# EAGLE schematic CPU68K20 - v1.1.2 (EAGLE 5.08)
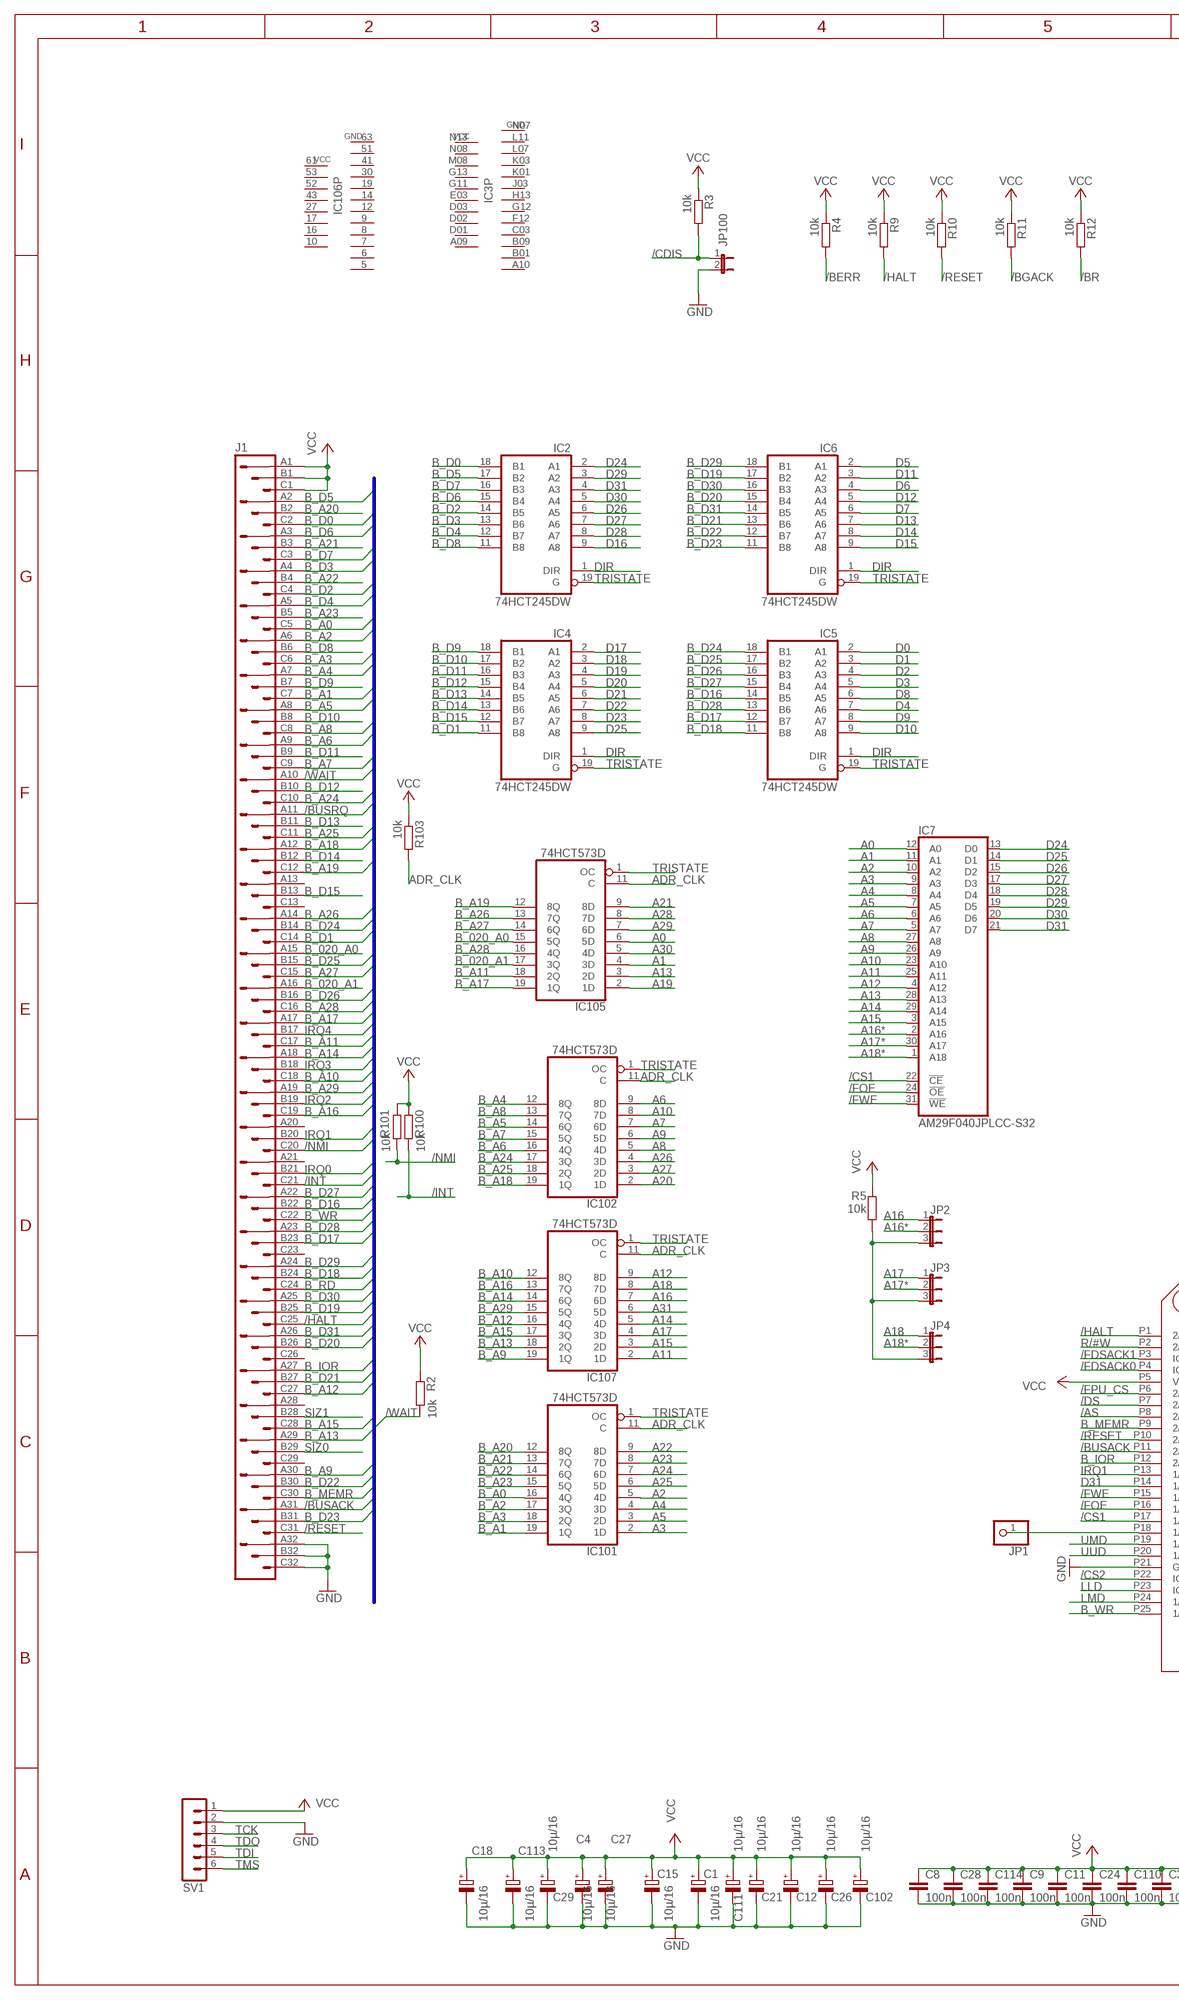
[diagram p0: schematic, sheet 1, part 1 of 2]
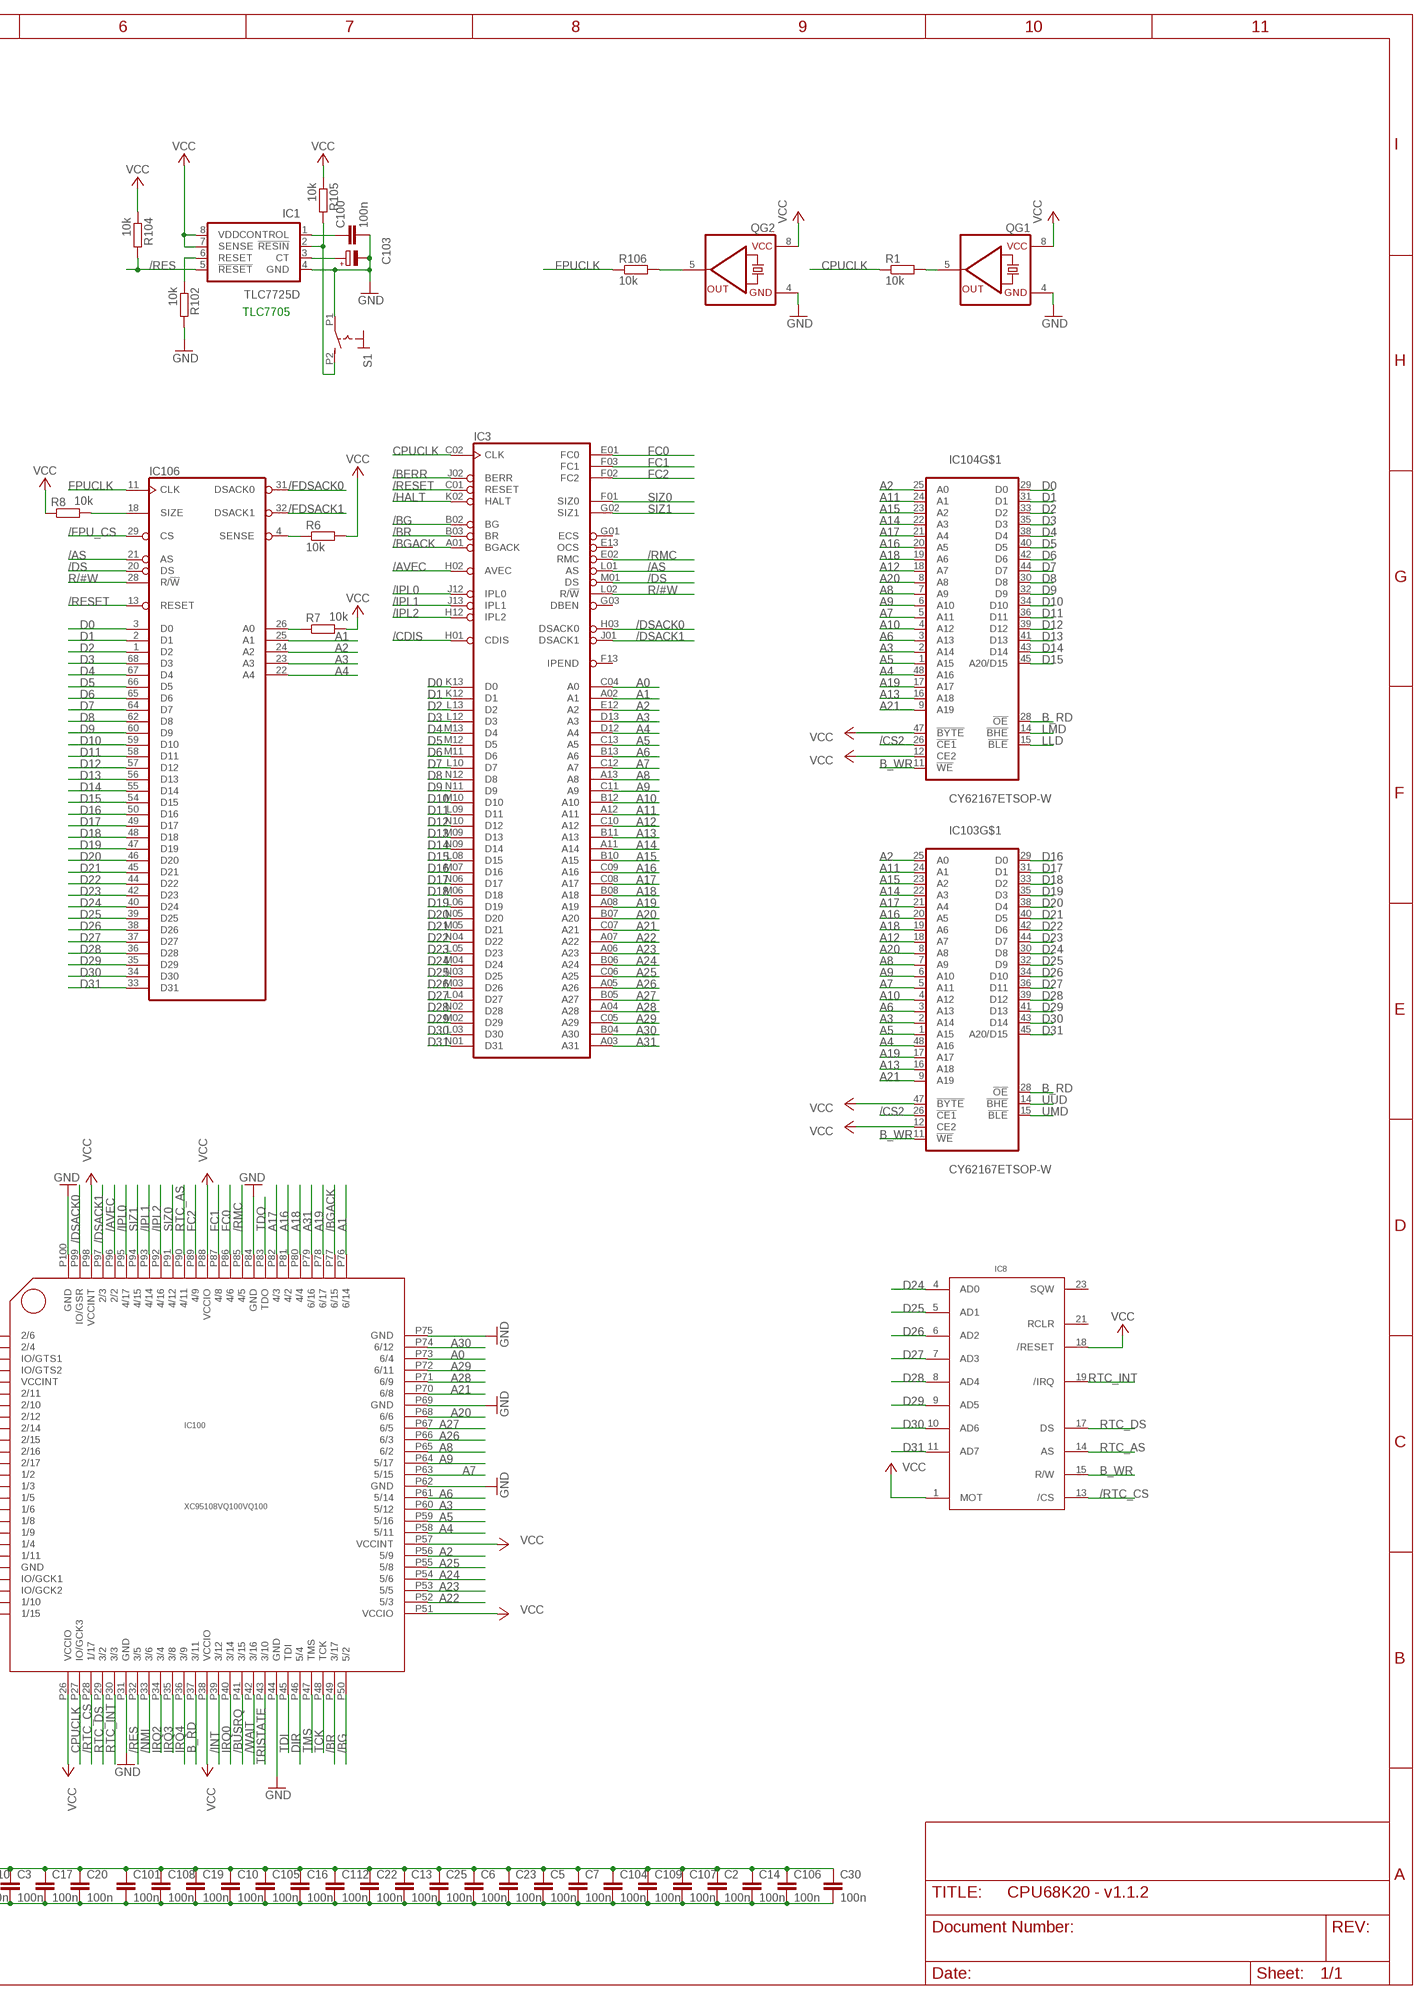
[diagram p1: schematic, sheet 1, part 2 of 2]

## Parts
C1  10µ/16  CPOL-EUSMCC  [SMC_C]
C2  100n  C-EUC0603K  [C0603K]
C3  100n  C-EUC0603K  [C0603K]
C4  10µ/16  CPOL-EUSMCC  [SMC_C]
C5  100n  C-EUC0603K  [C0603K]
C6  100n  C-EUC0603K  [C0603K]
C7  100n  C-EUC0603K  [C0603K]
C8  100n  C-EUC0603K  [C0603K]
C9  100n  C-EUC0603K  [C0603K]
C10  100n  C-EUC0603K  [C0603K]
C11  100n  C-EUC0603K  [C0603K]
C12  10µ/16  CPOL-EUSMCC  [SMC_C]
C13  100n  C-EUC0603K  [C0603K]
C14  100n  C-EUC0603K  [C0603K]
C15  10µ/16  CPOL-EUSMCC  [SMC_C]
C16  100n  C-EUC0603K  [C0603K]
C17  100n  C-EUC0603K  [C0603K]
C18  10µ/16  CPOL-EUSMCC  [SMC_C]
C19  100n  C-EUC0603K  [C0603K]
C20  100n  C-EUC0603K  [C0603K]
C21  10µ/16  CPOL-EUSMCC  [SMC_C]
C22  100n  C-EUC0603K  [C0603K]
C23  100n  C-EUC0603K  [C0603K]
C24  100n  C-EUC0603K  [C0603K]
C25  100n  C-EUC0603K  [C0603K]
C26  10µ/16  CPOL-EUSMCC  [SMC_C]
C27  10µ/16  CPOL-EUSMCC  [SMC_C]
C28  100n  C-EUC0603K  [C0603K]
C29  10µ/16  CPOL-EUSMCC  [SMC_C]
C30  100n  C-EUC0603K  [C0603K]
C100  100n  C-EUC0603K  [C0603K]
C101  100n  C-EUC0603K  [C0603K]
C102  10µ/16  CPOL-EUSMCC  [SMC_C]
C103  10µ/16  CPOL-EUSMCC  [SMC_C]
C104  100n  C-EUC0603K  [C0603K]
C105  100n  C-EUC0603K  [C0603K]
C106  100n  C-EUC0603K  [C0603K]
C107  100n  C-EUC0603K  [C0603K]
C108  100n  C-EUC0603K  [C0603K]
C109  100n  C-EUC0603K  [C0603K]
C110  100n  C-EUC0603K  [C0603K]
C111  10µ/16  CPOL-EUSMCC  [SMC_C]
C112  100n  C-EUC0603K  [C0603K]
C113  10µ/16  CPOL-EUSMCC  [SMC_C]
C114  100n  C-EUC0603K  [C0603K]
IC1  TLC7725D  [DIL08]
IC2  74HCT245DW  [SO20W]
IC3  MC68020RC  [MPGA114]
IC4  74HCT245DW  [SO20W]
IC5  74HCT245DW  [SO20W]
IC6  74HCT245DW  [SO20W]
IC7  AM29F040JPLCC-S32  [PLCC-S32]
IC8  DS12C887DIL24  [DIL24]
IC100  XC95108VQ100VQ100  [VQ100]
IC101  74HCT573D  [SO20W]
IC102  74HCT573D  [SO20W]
IC103  CY62167ETSOP-W  [TSOP48W]
IC104  CY62167ETSOP-W  [TSOP48W]
IC105  74HCT573D  [SO20W]
IC106  MC68881FN-SOC  [PLCC68-S]
IC107  74HCT573D  [SO20W]
J1  VG96P  [VG96P]
JP1  PINHD-1X1  [1X01]
JP2  JP2E  [JP2]
JP3  JP2E  [JP2]
JP4  JP2E  [JP2]
JP100  CDIS  JP1E  [JP1]
QG1  QG5460  [DIL08S]
QG2  QG5460  [DIL08S]
R1  10k  R-EU_M0805  [M0805]
R2  10k  R-EU_M0805  [M0805]
R3  10k  R-EU_M0805  [M0805]
R4  10k  R-EU_M0805  [M0805]
R5  10k  R-EU_M1206  [M1206]
R6  10k  R-EU_M0805  [M0805]
R7  10k  R-EU_M0805  [M0805]
R8  10k  R-EU_M0805  [M0805]
R9  10k  R-EU_M0805  [M0805]
R10  10k  R-EU_M0805  [M0805]
R11  10k  R-EU_M0805  [M0805]
R12  10k  R-EU_M0805  [M0805]
R100  10k  R-EU_M0805  [M0805]
R101  10k  R-EU_M0805  [M0805]
R102  10k  R-EU_M0805  [M0805]
R103  10k  R-EU_M0805  [M0805]
R104  10k  R-EU_M0805  [M0805]
R105  10k  R-EU_M1206  [M1206]
R106  10k  R-EU_M0805  [M0805]
S1  TS-21A  [TS-21A]
SV1  MA06-1  [MA06-1]

## Nets
/AS: IC3.L01(AS) IC100.P8(2/12) IC106.21(AS)
/AVEC: IC3.H02(AVEC) IC100.P96(2/2)
/BERR: IC3.J02(BERR) R4.2
/BG: IC3.B02(BG) IC100.P50(5/2)
/BGACK: IC3.A01(BGACK) IC100.P77(6/15) R11.2
/BR: IC3.B03(BR) IC100.P49(3/17) R12.2
/BUSACK: IC100.P11(2/16) J1.A31
/BUSRQ: IC100.P41(3/15) J1.A11
/CDIS: IC3.H01(CDIS) JP100.1 R3.2
/CS1: IC7.22(!CE) IC100.P17(1/8)
/CS2: IC100.P22(IO/GCK1) IC103.26(!CE1) IC104.26(!CE1)
/DS: IC3.M01(DS) IC100.P7(2/10) IC106.20(DS)
/DSACK0: IC3.H03(DSACK0) IC100.P99(IO/GSR)
/DSACK1: IC3.J01(DSACK1) IC100.P97(2/3)
/FDSACK0: IC100.P4(IO/GTS2) IC106.31(DSACK0)
/FDSACK1: IC100.P3(IO/GTS1) IC106.32(DSACK1)
/FOE: IC7.24(!OE) IC100.P16(1/6)
/FPU_CS: IC100.P6(2/11) IC106.29(CS)
/FWE: IC7.31(!WE) IC100.P15(1/5)
/HALT: IC3.K02(HALT) IC100.P1(2/6) J1.C25 R9.2
/INT: IC100.P39(3/12) J1.C21 R100.1
/IPL0: IC3.J12(IPL0) IC100.P95(4/17)
/IPL1: IC3.J13(IPL1) IC100.P93(4/14)
/IPL2: IC3.H12(IPL2) IC100.P92(4/16)
/NMI: IC100.P33(3/6) J1.C20 R101.1
/RES: IC1.5(!RESET) IC100.P32(3/5) R104.2
/RESET: IC3.C01(RESET) IC100.P10(2/15) IC106.13(RESET) J1.C31 R10.2
/RMC: IC3.E02(RMC) IC100.P85(4/5)
/RTC_CS: IC8.13(/CS) IC100.P28(1/17)
/WAIT: IC100.P42(3/16) J1.A10 R2.1
A0: IC3.C04(A0) IC7.12(A0) IC100.P73(6/4) IC105.6(5D)
A1: IC3.A02(A1) IC7.11(A1) IC100.P76(6/14) IC105.4(3D) IC106.25(A1)
A2: IC3.E12(A2) IC7.10(A2) IC100.P56(5/9) IC101.5(4D) IC103.25(A0) IC104.25(A0) IC106.24(A2)
A3: IC3.D13(A3) IC7.9(A3) IC100.P60(5/12) IC101.2(1D) IC103.2(A14) IC104.2(A14) IC106.23(A3)
A4: IC3.D12(A4) IC7.8(A4) IC100.P58(5/11) IC101.4(3D) IC103.48(A16) IC104.48(A16) IC106.22(A4)
A5: IC3.C13(A5) IC7.7(A5) IC100.P59(5/16) IC101.3(2D) IC103.1(A15) IC104.1(A15)
A6: IC3.B13(A6) IC7.6(A6) IC100.P61(5/14) IC102.9(8D) IC103.3(A13) IC104.3(A13)
A7: IC3.C12(A7) IC7.5(A7) IC100.P63(5/15) IC102.7(6D) IC103.5(A11) IC104.5(A11)
A8: IC3.A13(A8) IC7.27(A8) IC100.P65(6/2) IC102.5(4D) IC103.7(A9) IC104.7(A9)
A9: IC3.C11(A9) IC7.26(A9) IC100.P64(5/17) IC102.6(5D) IC103.6(A10) IC104.6(A10)
A10: IC3.B12(A10) IC7.23(A10) IC102.8(7D) IC103.4(A12) IC104.4(A12)
A11: IC3.A12(A11) IC7.25(A11) IC103.24(A1) IC104.24(A1) IC107.2(1D)
A12: IC3.C10(A12) IC7.4(A12) IC103.18(A7) IC104.18(A7) IC107.9(8D)
A13: IC3.B11(A13) IC7.28(A13) IC103.16(A18) IC104.16(A18) IC105.3(2D)
A14: IC3.A11(A14) IC7.29(A14) IC103.22(A3) IC104.22(A3) IC107.5(4D)
A15: IC3.B10(A15) IC7.3(A15) IC103.23(A2) IC104.23(A2) IC107.3(2D)
A16: IC3.C09(A16) IC100.P81(4/2) IC103.20(A5) IC104.20(A5) IC107.7(6D) JP2.1
A16*: IC7.2(A16) JP2.2
A17: IC3.C08(A17) IC100.P82(4/3) IC103.21(A4) IC104.21(A4) IC107.4(3D) JP3.1
A17*: IC7.30(A17) JP3.2
A18: IC3.B08(A18) IC100.P80(4/4) IC103.19(A6) IC104.19(A6) IC107.8(7D) JP4.1
A18*: IC7.1(A18) JP4.2
A19: IC3.A08(A19) IC100.P78(6/17) IC103.17(A17) IC104.17(A17) IC105.2(1D)
A20: IC3.B07(A20) IC100.P68(6/6) IC102.2(1D) IC103.8(A8) IC104.8(A8)
A21: IC3.C07(A21) IC100.P70(6/8) IC103.9(A19) IC104.9(A19) IC105.9(8D)
A22: IC3.A07(A22) IC100.P52(5/3) IC101.9(8D)
A23: IC3.A06(A23) IC100.P53(5/5) IC101.8(7D)
A24: IC3.B06(A24) IC100.P54(5/6) IC101.7(6D)
A25: IC3.C06(A25) IC100.P55(5/8) IC101.6(5D)
A26: IC3.A05(A26) IC100.P66(6/3) IC102.4(3D)
A27: IC3.B05(A27) IC100.P67(6/5) IC102.3(2D)
A28: IC3.A04(A28) IC100.P71(6/9) IC105.8(7D)
A29: IC3.C05(A29) IC100.P72(6/11) IC105.7(6D)
A30: IC3.B04(A30) IC100.P74(6/12) IC105.5(4D)
A31: IC3.A03(A31) IC100.P79(6/16) IC107.6(5D)
ADR_CLK: IC101.11(C) IC102.11(C) IC105.11(C) IC107.11(C) R103.2
B_020_A0: IC105.15(5Q) J1.A15
B_020_A1: IC105.17(3Q) J1.A16
B_A0: IC101.16(4Q) J1.C5
B_A1: IC101.19(1Q) J1.C7
B_A2: IC101.17(3Q) J1.A6
B_A3: IC101.18(2Q) J1.C6
B_A4: IC102.12(8Q) J1.A7
B_A5: IC102.14(6Q) J1.A8
B_A6: IC102.16(4Q) J1.A9
B_A7: IC102.15(5Q) J1.C9
B_A8: IC102.13(7Q) J1.C8
B_A9: IC107.19(1Q) J1.A30
B_A10: IC107.12(8Q) J1.C18
B_A11: IC105.18(2Q) J1.C17
B_A12: IC107.16(4Q) J1.C27
B_A13: IC107.18(2Q) J1.A29
B_A14: IC107.14(6Q) J1.A18
B_A15: IC107.17(3Q) J1.C28
B_A16: IC107.13(7Q) J1.C19
B_A17: IC105.19(1Q) J1.A17
B_A18: IC102.19(1Q) J1.A12
B_A19: IC105.12(8Q) J1.C12
B_A20: IC101.12(8Q) J1.B2
B_A21: IC101.13(7Q) J1.B3
B_A22: IC101.14(6Q) J1.B4
B_A23: IC101.15(5Q) J1.B5
B_A24: IC102.17(3Q) J1.C10
B_A25: IC102.18(2Q) J1.C11
B_A26: IC105.13(7Q) J1.A14
B_A27: IC105.14(6Q) J1.C15
B_A28: IC105.16(4Q) J1.C16
B_A29: IC107.15(5Q) J1.A19
B_D0: IC2.18(B1) J1.C2
B_D1: IC4.11(B8) J1.C14
B_D2: IC2.14(B5) J1.C4
B_D3: IC2.13(B6) J1.A4
B_D4: IC2.12(B7) J1.A5
B_D5: IC2.17(B2) J1.A2
B_D6: IC2.15(B4) J1.A3
B_D7: IC2.16(B3) J1.C3
B_D8: IC2.11(B8) J1.B6
B_D9: IC4.18(B1) J1.B7
B_D10: IC4.17(B2) J1.B8
B_D11: IC4.16(B3) J1.B9
B_D12: IC4.15(B4) J1.B10
B_D13: IC4.14(B5) J1.B11
B_D14: IC4.13(B6) J1.B12
B_D15: IC4.12(B7) J1.B13
B_D16: IC5.14(B5) J1.B22
B_D17: IC5.12(B7) J1.B23
B_D18: IC5.11(B8) J1.B24
B_D19: IC6.17(B2) J1.B25
B_D20: IC6.15(B4) J1.B26
B_D21: IC6.13(B6) J1.B27
B_D22: IC6.12(B7) J1.B30
B_D23: IC6.11(B8) J1.B31
B_D24: IC5.18(B1) J1.B14
B_D25: IC5.17(B2) J1.B15
B_D26: IC5.16(B3) J1.B16
B_D27: IC5.15(B4) J1.A22
B_D28: IC5.13(B6) J1.A23
B_D29: IC6.18(B1) J1.A24
B_D30: IC6.16(B3) J1.A25
B_D31: IC6.14(B5) J1.A26
B_IOR: IC100.P12(2/17) J1.A27
B_MEMR: IC100.P9(2/14) J1.C30
B_RD: IC100.P37(3/11) IC103.28(!OE) IC104.28(!OE) J1.C24
B_WR: IC8.15(R/W) IC100.P25(1/15) IC103.11(!WE) IC104.11(!WE) J1.C22
CPUCLK: IC3.C02(CLK) IC100.P27(IO/GCK3) R1.1
D0: IC3.K13(D0) IC5.2(A1) IC104.29(D0) IC106.3(D0)
D1: IC3.K12(D1) IC5.3(A2) IC104.31(D1) IC106.2(D1)
D2: IC3.L13(D2) IC5.4(A3) IC104.33(D2) IC106.1(D2)
D3: IC3.L12(D3) IC5.5(A4) IC104.35(D3) IC106.68(D3)
D4: IC3.M13(D4) IC5.7(A6) IC104.38(D4) IC106.67(D4)
D5: IC3.M12(D5) IC6.2(A1) IC104.40(D5) IC106.66(D5)
D6: IC3.M11(D6) IC6.4(A3) IC104.42(D6) IC106.65(D6)
D7: IC3.L10(D7) IC6.6(A5) IC104.44(D7) IC106.64(D7)
D8: IC3.N12(D8) IC5.6(A5) IC104.30(D8) IC106.62(D8)
D9: IC3.N11(D9) IC5.8(A7) IC104.32(D9) IC106.60(D9)
D10: IC3.M10(D10) IC5.9(A8) IC104.34(D10) IC106.59(D10)
D11: IC3.L09(D11) IC6.3(A2) IC104.36(D11) IC106.58(D11)
D12: IC3.N10(D12) IC6.5(A4) IC104.39(D12) IC106.57(D12)
D13: IC3.M09(D13) IC6.7(A6) IC104.41(D13) IC106.56(D13)
D14: IC3.N09(D14) IC6.8(A7) IC104.43(D14) IC106.55(D14)
D15: IC3.L08(D15) IC6.9(A8) IC104.45(A20/D15) IC106.54(D15)
D16: IC2.9(A8) IC3.M07(D16) IC103.29(D0) IC106.50(D16)
D17: IC3.N06(D17) IC4.2(A1) IC103.31(D1) IC106.49(D17)
D18: IC3.M06(D18) IC4.3(A2) IC103.33(D2) IC106.48(D18)
D19: IC3.L06(D19) IC4.4(A3) IC103.35(D3) IC106.47(D19)
D20: IC3.N05(D20) IC4.5(A4) IC103.38(D4) IC106.46(D20)
D21: IC3.M05(D21) IC4.6(A5) IC103.40(D5) IC106.45(D21)
D22: IC3.N04(D22) IC4.7(A6) IC103.42(D6) IC106.44(D22)
D23: IC3.L05(D23) IC4.8(A7) IC103.44(D7) IC106.42(D23)
D24: IC2.2(A1) IC3.M04(D24) IC7.13(D0) IC8.4(AD0) IC103.30(D8) IC106.40(D24)
D25: IC3.N03(D25) IC4.9(A8) IC7.14(D1) IC8.5(AD1) IC103.32(D9) IC106.39(D25)
D26: IC2.6(A5) IC3.M03(D26) IC7.15(D2) IC8.6(AD2) IC103.34(D10) IC106.38(D26)
D27: IC2.7(A6) IC3.L04(D27) IC7.17(D3) IC8.7(AD3) IC103.36(D11) IC106.37(D27)
D28: IC2.8(A7) IC3.N02(D28) IC7.18(D4) IC8.8(AD4) IC103.39(D12) IC106.36(D28)
D29: IC2.3(A2) IC3.M02(D29) IC7.19(D5) IC8.9(AD5) IC103.41(D13) IC106.35(D29)
D30: IC2.5(A4) IC3.L03(D30) IC7.20(D6) IC8.10(AD6) IC103.43(D14) IC106.34(D30)
D31: IC2.4(A3) IC3.N01(D31) IC7.21(D7) IC8.11(AD7) IC100.P14(1/3) IC103.45(A20/D15) IC106.33(D31)
DIR: IC2.1(DIR) IC4.1(DIR) IC5.1(DIR) IC6.1(DIR) IC100.P46(5/4)
FC0: IC3.E01(FC0) IC100.P86(4/6)
FC1: IC3.F03(FC1) IC100.P87(4/8)
FC2: IC3.F02(FC2) IC100.P89(4/9)
FPUCLK: IC106.11(CLK) R106.1
GND: C1.- C2.2 C3.2 C4.- C5.2 C6.2 C7.2 C8.2 C9.2 C10.2 C11.2 C12.- C13.2 C14.2 C15.- C16.2 C17.2 C18.- C19.2 C20.2 C21.- C22.2 C23.2 C24.2 C25.2 C26.- C27.- C28.2 C29.- C30.2 C100.2 C101.2 C102.- C103.- C104.2 C105.2 C106.2 C107.2 C108.2 C109.2 C110.2 C111.- C112.2 C113.- C114.2 IC1.4(GND) IC100.P21(GND) IC100.P31(GND) IC100.P44(GND) IC100.P62(GND) IC100.P69(GND) IC100.P75(GND) IC100.P84(GND) IC100.P100(GND) J1.A32 J1.B32 J1.C32 JP100.2 QG1.4(GND) QG2.4(GND) R102.2 S1.P1(P) SV1.2
IRQ0: IC100.P40(3/14) J1.B21
IRQ1: IC100.P13(1/2) J1.B20
IRQ2: IC100.P34(3/4) J1.B19
IRQ3: IC100.P35(3/8) J1.B18
IRQ4: IC100.P36(3/9) J1.B17
LLD: IC100.P23(IO/GCK2) IC104.15(!BLE)
LMD: IC100.P24(1/10) IC104.14(!BHE)
N$1: IC1.6(RESET) R102.1
N$2: IC100.P18(1/9) JP1.1
N$3: QG2.5(OUT) R106.2
N$4: C103.+ IC1.3(CT)
N$5: QG1.5(OUT) R1.2
N$6: C100.1 IC1.1(CONTROL)
N$7: IC1.2(!RESIN) R105.2 S1.P2(S)
N$8: JP2.3 JP3.3 JP4.3 R5.1
N$11: IC106.4(SENSE) R6.1
N$12: IC106.18(SIZE) R8.2
N$13: IC106.26(A0) R7.1
R/#W: IC3.L02(R/!W) IC100.P2(2/4) IC106.28(R/!W)
RTC_AS: IC8.14(AS) IC100.P90(4/11)
RTC_DS: IC8.17(DS) IC100.P29(3/2)
RTC_INT: IC8.19(/IRQ) IC100.P30(3/3)
SIZ0: IC3.F01(SIZ0) IC100.P91(4/12) J1.B29
SIZ1: IC3.G02(SIZ1) IC100.P94(4/15) J1.B28
TCK: IC100.P48(TCK) SV1.3
TDI: IC100.P45(TDI) SV1.5
TDO: IC100.P83(TDO) SV1.4
TMS: IC100.P47(TMS) SV1.6
TRISTATE: IC2.19(G) IC4.19(G) IC5.19(G) IC6.19(G) IC100.P43(3/10) IC101.1(OC) IC102.1(OC) IC105.1(OC) IC107.1(OC)
UMD: IC100.P19(1/4) IC103.15(!BLE)
UUD: IC100.P20(1/11) IC103.14(!BHE)
VCC: C1.+ C2.1 C3.1 C4.+ C5.1 C6.1 C7.1 C8.1 C9.1 C10.1 C11.1 C12.+ C13.1 C14.1 C15.+ C16.1 C17.1 C18.+ C19.1 C20.1 C21.+ C22.1 C23.1 C24.1 C25.1 C26.+ C27.+ C28.1 C29.+ C30.1 C101.1 C102.+ C104.1 C105.1 C106.1 C107.1 C108.1 C109.1 C110.1 C111.+ C112.1 C113.+ C114.1 IC1.7(SENSE) IC1.8(VDD) IC8.1(MOT) IC8.18(/RESET) IC100.P5(VCCINT) IC100.P26(VCCIO) IC100.P38(VCCIO) IC100.P51(VCCIO) IC100.P57(VCCINT) IC100.P88(VCCIO) IC100.P98(VCCINT) IC103.12(CE2) IC103.47(!BYTE) IC104.12(CE2) IC104.47(!BYTE) J1.A1 J1.B1 J1.C1 QG1.8(VCC) QG2.8(VCC) R2.2 R3.1 R4.1 R5.2 R6.2 R7.2 R8.1 R9.1 R10.1 R11.1 R12.1 R100.2 R101.2 R103.1 R104.1 R105.1 SV1.1
Unconnected: IC3.E13(OCS) IC3.F13(IPEND) IC3.G01(ECS) IC3.G03(DBEN) IC8.21(RCLR) IC8.23(SQW) IC103.10(NC) IC103.13(NC) IC104.10(NC) IC104.13(NC) J1.A13 J1.A20 J1.A21 J1.A28 J1.C13 J1.C23 J1.C26 J1.C29

## Buses
B_D[0..31],B_A[0..31],IRQ[0..7],B_BANK,B_HALT,B_RD,B_WR,B_IOR,B_MEMR,B_M1,B_RFSH,B_BACK,/INT,/NMI,/RESET,/WAIT,/BUSRQ,CLK

## Notes on the sheet
- TLC7705

## Power pins joined to a net without a drawn wire
GND: IC2.10(GND) IC3.A10(GND) IC3.B01(GND) IC3.B09(GND) IC3.C03(GND) IC3.F12(GND) IC3.G12(GND) IC3.H13(GND) IC3.J03(GND) IC3.K01(GND) IC3.K03(GND) IC3.L07(GND) IC3.L11(GND) IC3.N07(GND) IC4.10(GND) IC5.10(GND) IC6.10(GND) IC7.16(GND) IC8.12(GND) IC101.10(GND) IC102.10(GND) IC103.27(GND) IC103.46(GND) IC104.27(GND) IC104.46(GND) IC105.10(GND) IC106.5(GND) IC106.6(GND) IC106.7(GND) IC106.8(GND) IC106.9(GND) IC106.12(GND) IC106.14(GND) IC106.19(GND) IC106.30(GND) IC106.41(GND) IC106.51(GND) IC106.63(GND) IC107.10(GND)
VCC: IC2.20(VCC) IC3.A09(VCC) IC3.D01(VCC) IC3.D02(VCC) IC3.D03(VCC) IC3.E03(VCC) IC3.G11(VCC) IC3.G13(VCC) IC3.M08(VCC) IC3.N08(VCC) IC3.N13(VCC) IC4.20(VCC) IC5.20(VCC) IC6.20(VCC) IC7.32(VCC) IC8.24(VCC) IC101.20(VCC) IC102.20(VCC) IC103.37(VCC) IC104.37(VCC) IC105.20(VCC) IC106.10(VCC) IC106.16(VCC) IC106.17(VCC) IC106.27(VCC) IC106.43(VCC) IC106.52(VCC) IC106.53(VCC) IC106.61(VCC) IC107.20(VCC)

## Library data of the parts
C1 C4 C12 C15 C18 C21 C26 C27 C29 C102 C103 C111 C113 = rcl:CPOL-EU: POLARIZED CAPACITOR, European symbol
C2 C3 C5-C11 C13 C14 C16 C17 C19 C20 C22-C25 C28 C30 C100 C101 C104-C110 C112 C114 = rcl:C-EU: CAPACITOR, European symbol
IC1 = texas:TLC77*: MICROPOWER SUPPLY VOLTAGE SUPERVISORS Source: www.ti.com/.. slvs087l.pdf
IC2 IC4-IC6 = 74xx-eu:74*245: Octal BUS TRANSCEIVER, 3-state
IC3 = micro-mc68000:MC68020RC: 68xxx PROCESSOR
IC7 = am29-memory:AM29F040J: 4-Megabit FLASH MEMORY (512 K x 8 bit) 5 V-only
IC8 = DALLAS:DS12C887
IC100 = Xilinx:XC95108VQ100
IC101 IC102 IC105 IC107 = 74xx-eu:74*573: 8-bit D latch BUS DRIVER
IC103 IC104 = memory-cypress:CY62167E
IC106 = micro-mc68000:MC68881FN: 68xxx PROCESSOR
J1 = 19inch:VG96: PCB EUROCARD, 96-pin type C/ABC, 2.54 mm
JP1 = pinhead:PINHD-1X1: PIN HEADER
JP2-JP4 = jumper:JP2E: JUMPER
JP100 = jumper:JP1E: JUMPER
QG1 QG2 = crystal:QG5460: CRYSTAL RESONATOR
R1-R12 R100-R106 = rcl:R-EU_: RESISTOR, European symbol
S1 = switch:TS-21A: TOGGLE SWITCH
SV1 = con-lstb:MA06-1: PIN HEADER